# Altium schematic sheet BrewBitTC.SchDoc
size B
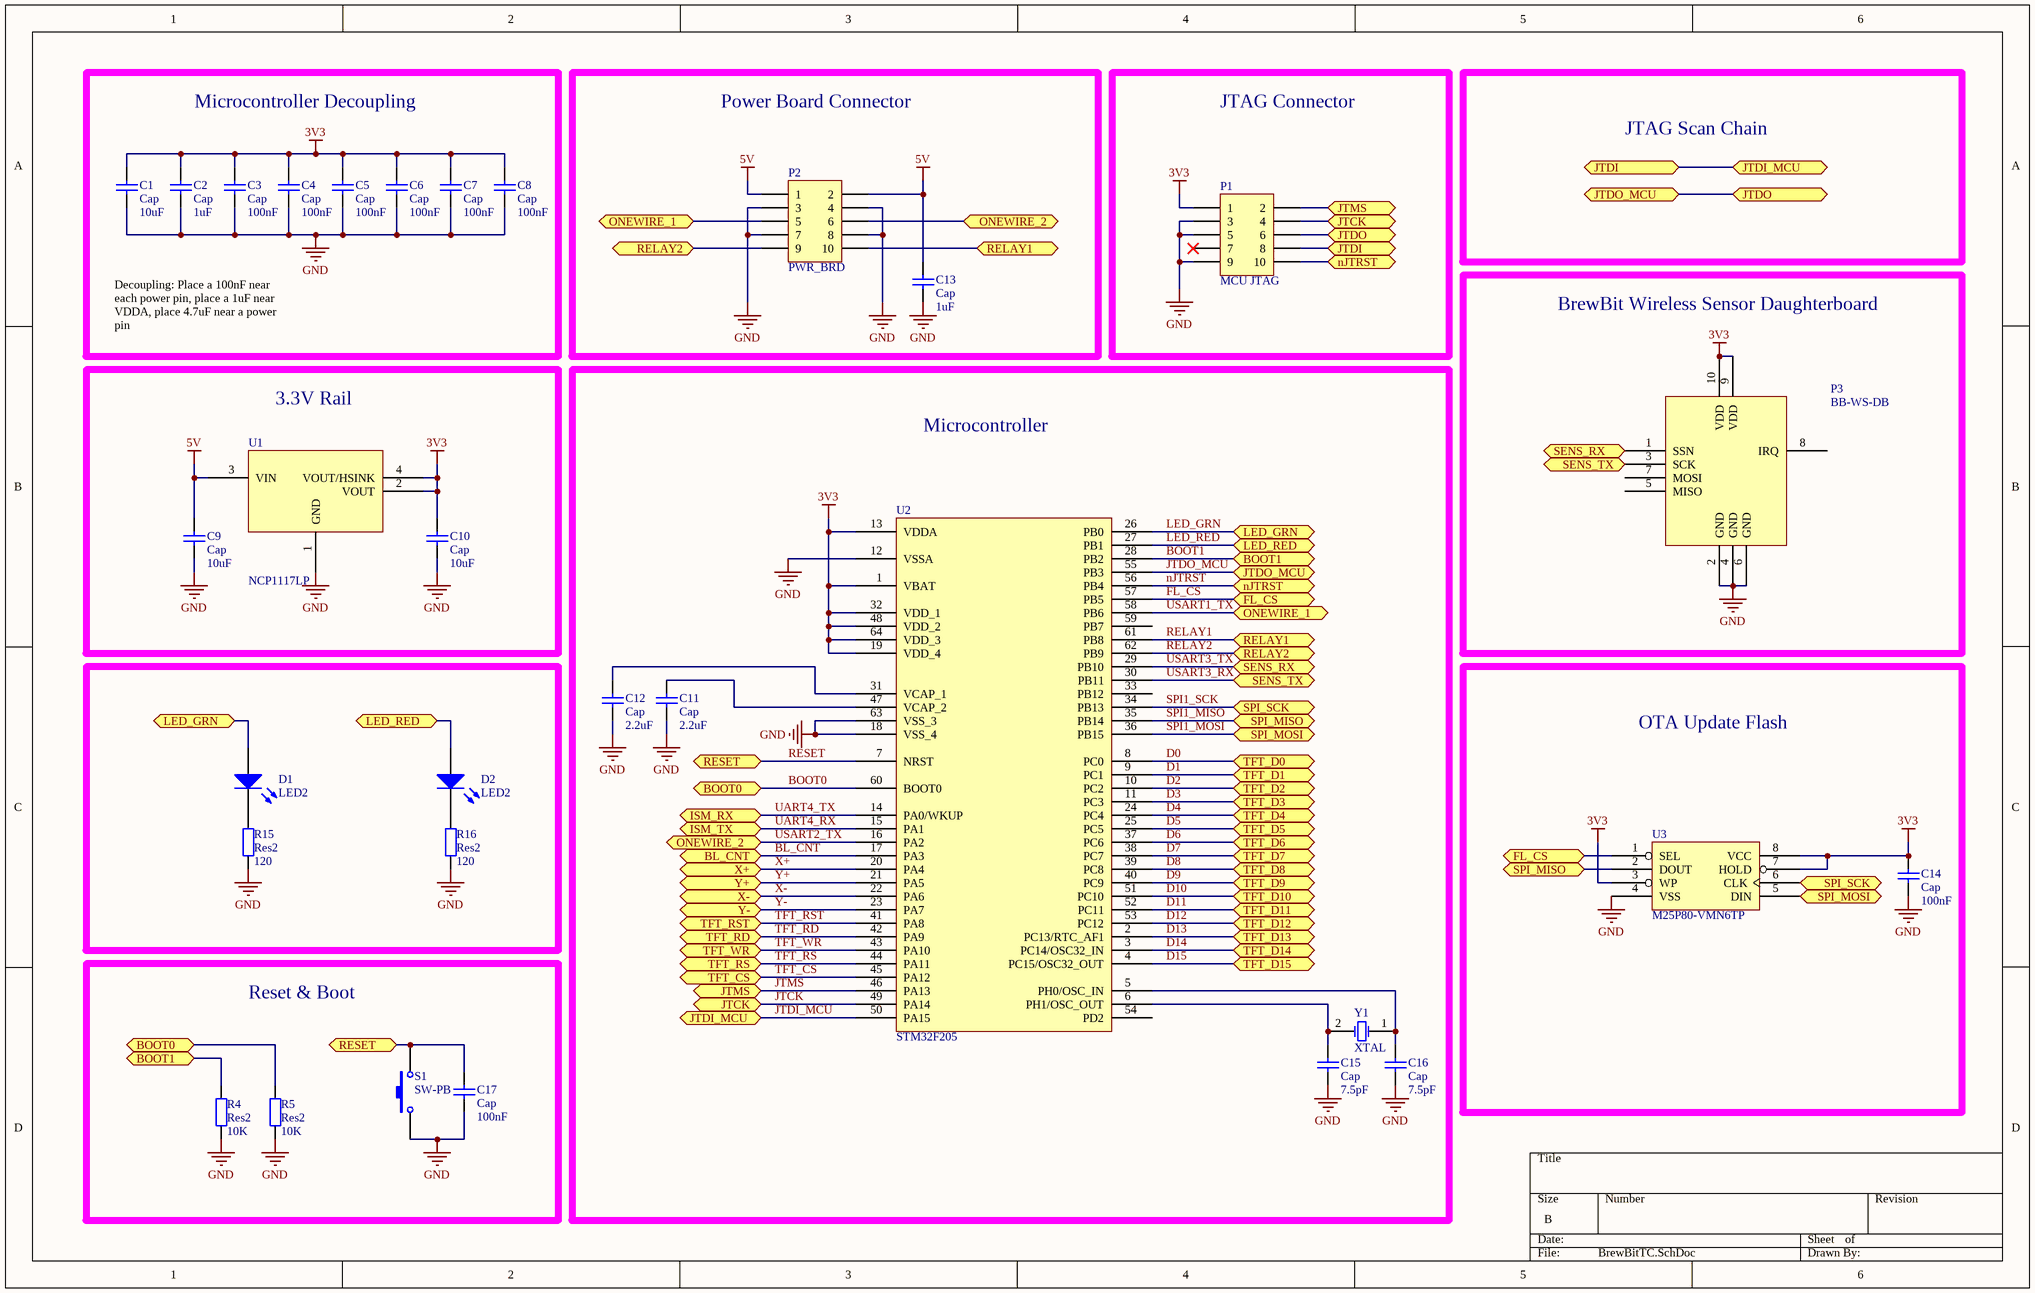
[diagram p0: BrewBitTC.SchDoc]

## Parts
C1  Cap  value 10uF  [0805]
C2  Cap  value 1uF  [0603]
C3  Cap  value 100nF  [0603]
C4  Cap  value 100nF  [0603]
C5  Cap  value 100nF  [0603]
C6  Cap  value 100nF  [0603]
C7  Cap  value 100nF  [0603]
C8  Cap  value 100nF  [0603]
C9  Cap  value 10uF  [0805]
C10  Cap  value 10uF  [0805]
C11  Cap  value 2.2uF  [0603]
C12  Cap  value 2.2uF  [0603]
C13  Cap  value 1uF  [0603]
C14  Cap  value 100nF  [0603]
C15  Cap  value 7.5pF  [0603]
C16  Cap  value 7.5pF  [0603]
C17  Cap  value 100nF  [0603]
D1  LED2  [0603]
D2  LED2  [0603]
P1  MCU JTAG  [5x2 PIN SMT HEADER]
P2  PWR_BRD  [5X2 PIN SMT HEADER - 2.0MM]
P3  BB-WS-DB  [10 Pin SMT Header]
R4  Res2  value 10K  [0603]
R5  Res2  value 10K  [0603]
R15  Res2  value 120  [0603]
R16  Res2  value 120  [0603]
S1  SW-PB  [FSM4JSMA]
U1  NCP1117LP  [SOT-223]
U2  STM32F205  [LQFP64]
U3  M25P80-VMN6TP  [SO8N]
Y1  XTAL  [HC49SD XTAL]

## Blocks framed on the sheet
Microcontroller Decoupling: C1-C8
Power Board Connector: C13 P2
JTAG Connector: P1
BrewBit Wireless Sensor Daughterboard: P3
3.3V Rail: C9 C10 U1
Microcontroller: C11 C12 C15 C16 U2 Y1
OTA Update Flash: C14 U3
Reset & Boot: C17 R4 R5 S1

## Ports
BL_CNT, BOOT0, BOOT1, FL_CS, ISM_RX, ISM_TX, JTCK, JTDI, JTDI_MCU, JTDO, JTDO_MCU, JTMS, LED_GRN, LED_RED, nJTRST, ONEWIRE_1, ONEWIRE_2, RELAY1, RELAY2, RESET, SENS_RX, SENS_TX, SPI_MISO, SPI_MOSI, SPI_SCK, TFT_CS, TFT_D0, TFT_D1, TFT_D2, TFT_D3, TFT_D4, TFT_D5, TFT_D6, TFT_D7, TFT_D8, TFT_D9, TFT_D10, TFT_D11, TFT_D12, TFT_D13, TFT_D14, TFT_D15, TFT_RD, TFT_RS, TFT_RST, TFT_WR, X+, X-, Y+, Y-

## Nets
3V3: C1.2 C2.2 C3.2 C4.2 C5.2 C6.2 C7.2 C8.2 C10.2 C14.2 P1.1 P3.9(VDD) P3.10(VDD) U1.2(VOUT) U1.4(VOUT/HSINK) U2.1(VBAT) U2.13(VDDA) U2.19(VDD_4) U2.32(VDD_1) U2.48(VDD_2) U2.64(VDD_3) U3.3(WP) U3.7(HOLD) U3.8(VCC)
5V: C9.2 C13.2 P2.1 P2.2 U1.3(VIN)
GND: C1.1 C2.1 C3.1 C4.1 C5.1 C6.1 C7.1 C8.1 C9.1 C10.1 C11.1 C12.1 C13.1 C14.1 C15.1 C16.1 C17.1 P1.3 P1.5 P1.9 P2.3 P2.4 P2.7 P2.8 P3.2(GND) P3.4(GND) P3.6(GND) R4.1 R5.1 R15.1 R16.1 S1.1 U1.1(GND) U2.12(VSSA) U2.18(VSS_4) U2.63(VSS_3) U3.4(VSS)
BL_CNT: U2.17(PA3) ; port BL_CNT
BOOT0: R5.2 U2.60(BOOT0) ; port BOOT0
BOOT1: R4.2 U2.28(PB2) ; port BOOT1
D0: U2.8(PC0) ; port TFT_D0
D1: U2.9(PC1) ; port TFT_D1
D2: U2.10(PC2) ; port TFT_D2
D3: U2.11(PC3) ; port TFT_D3
D4: U2.24(PC4) ; port TFT_D4
D5: U2.25(PC5) ; port TFT_D5
D6: U2.37(PC6) ; port TFT_D6
D7: U2.38(PC7) ; port TFT_D7
D8: U2.39(PC8) ; port TFT_D8
D9: U2.40(PC9) ; port TFT_D9
D10: U2.51(PC10) ; port TFT_D10
D11: U2.52(PC11) ; port TFT_D11
D12: U2.53(PC12) ; port TFT_D12
D13: U2.2(PC13/RTC_AF1) ; port TFT_D13
D14: U2.3(PC14/OSC32_IN) ; port TFT_D14
D15: U2.4(PC15/OSC32_OUT) ; port TFT_D15
FL_CS: U2.57(PB5) U3.1(SEL) ; port FL_CS
JTCK: P1.4 U2.49(PA14) ; port JTCK
JTDI_MCU: P1.8 U2.50(PA15) ; port JTDI, port JTDI_MCU
JTDO_MCU: P1.6 U2.55(PB3) ; port JTDO, port JTDO_MCU
JTMS: P1.2 U2.46(PA13) ; port JTMS
LED_GRN: D1.1(A) U2.26(PB0) ; port LED_GRN
LED_RED: D2.1(A) U2.27(PB1) ; port LED_RED
nJTRST: P1.10 U2.56(PB4) ; port nJTRST
RELAY1: P2.10 U2.61(PB8) ; port RELAY1
RELAY2: P2.9 U2.62(PB9) ; port RELAY2
RESET: C17.2 S1.2 U2.7(NRST) ; port RESET
SPI1_MISO: U2.35(PB14) U3.2(DOUT) ; port SPI_MISO
SPI1_MOSI: U2.36(PB15) U3.5(DIN) ; port SPI_MOSI
SPI1_SCK: U2.34(PB13) U3.6(CLK) ; port SPI_SCK
TFT_CS: U2.45(PA12) ; port TFT_CS
TFT_RD: U2.42(PA9) ; port TFT_RD
TFT_RS: U2.44(PA11) ; port TFT_RS
TFT_RST: U2.41(PA8) ; port TFT_RST
TFT_WR: U2.43(PA10) ; port TFT_WR
UART4_RX: U2.15(PA1) ; port ISM_TX
UART4_TX: U2.14(PA0/WKUP) ; port ISM_RX
USART1_TX: P2.5 U2.58(PB6) ; port ONEWIRE_1
USART2_TX: P2.6 U2.16(PA2) ; port ONEWIRE_2
USART3_RX: P3.3(SCK) U2.30(PB11) ; port SENS_TX
USART3_TX: P3.1(SSN) U2.29(PB10) ; port SENS_RX
X+: U2.20(PA4) ; port X+
X-: U2.22(PA6) ; port X-
Y+: U2.21(PA5) ; port Y+
Y-: U2.23(PA7) ; port Y-
NetC11_2: C11.2 U2.47(VCAP_2)
NetC12_2: C12.2 U2.31(VCAP_1)
NetC15_2: C15.2 U2.6(PH1/OSC_OUT) Y1.2(OSC2)
NetC16_2: C16.2 U2.5(PH0/OSC_IN) Y1.1(OSC1)
NetD1_2: D1.2(K) R15.2
NetD2_2: D2.2(K) R16.2

Not connected (* = marked no-connect by the designer): P1 7*; P3 5(MISO) 7(MOSI) 8(IRQ); U2 33(PB12) 54(PD2) 59(PB7)

## Notes on the sheet
- JTAG Scan Chain
- Decoupling: Place a 100nF near each power pin, place a 1uF near VDDA, place 4.7uF near a power pin

## Library data of the parts
C1-C17 = Cap: Capacitor; Supplier 1: Digi-Key
  C1 C9 C10: Supplier Part Number 1: 445-6857-1-ND
  C2 C13: Supplier Part Number 1: 587-1242-1-ND
  C3-C8 C14 C17: Supplier Part Number 1: 399-1095-1-ND
  C11 C12: Supplier Part Number 1: 587-2983-1-ND
  C15 C16: Supplier Part Number 1: 490-3565-1-ND
D1 D2 = LED2: Typical RED, GREEN, YELLOW, AMBER GaAs LED; Supplier 1: Digi-Key
  D1: Supplier Part Number 1: 160-1183-1-ND
  D2: Supplier Part Number 1: 160-1181-1-ND
P1 P2 = Header 5X2: Header, 5-Pin, Dual row; Supplier 1: Digi-Key
  P1: Supplier Part Number 1: S9012E-05-ND
  P2: Supplier Part Number 1: 609-2648-1-ND
P3 = BB-WS-DB: BrewBit Wireless Sensor Daughter Board; Supplier Part Number 1: 3M9359CT-ND; Supplier 1: Digi-Key
R4 R5 R15 R16 = Res2: Resistor; Supplier 1: Digi-Key
  R4 R5: Supplier Part Number 1: 311-10KGRCT-ND
  R15 R16: Supplier Part Number 1: P120GCT-ND
S1 = SW-PB: Switch; Supplier Part Number 1: 450-1129-ND; Supplier 1: Digi-Key
U1 = NCP1117LP: 1.0 A Low-Dropout Positive  Fixed and Adjustable  Voltage Regulators; Supplier 1: Digi-Key; Supplier Part Number 1: NCP1117LPST33T3GOSCT-ND
U2 = STM32F20x-LQFP64: STMicroelectronics STM32F20x LQFP64; Supplier 1: Digi-Key; Supplier Part Number 1: 497-11155-ND
U3 = M25P80-VMN6TP: IC FLASH 8MBIT 75MHZ SO8N; Supplier 1: Digi-Key; Supplier Part Number 1: M25P80-VMN6TPCT-ND
Y1 = XTAL: Crystal Oscillator; Supplier 1: Digi-Key; Supplier Part Number 1: 631-1010-1-ND